# EAGLE board openx3 (EAGLE 9.5.2)
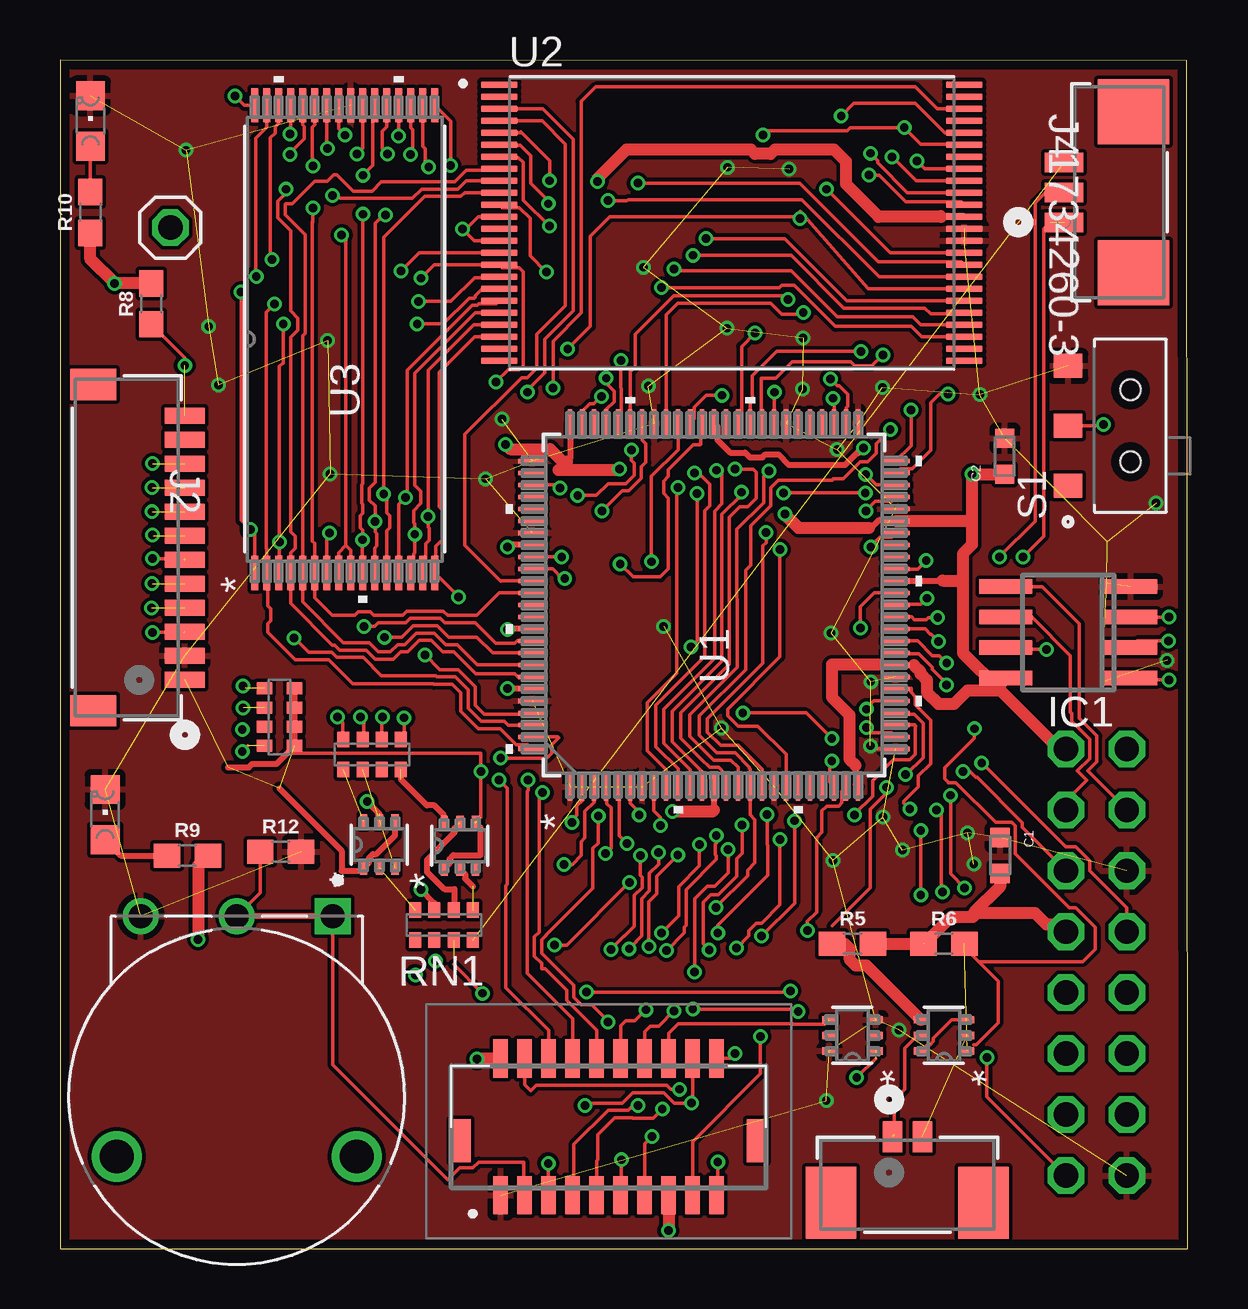
[diagram p2: board, top side]
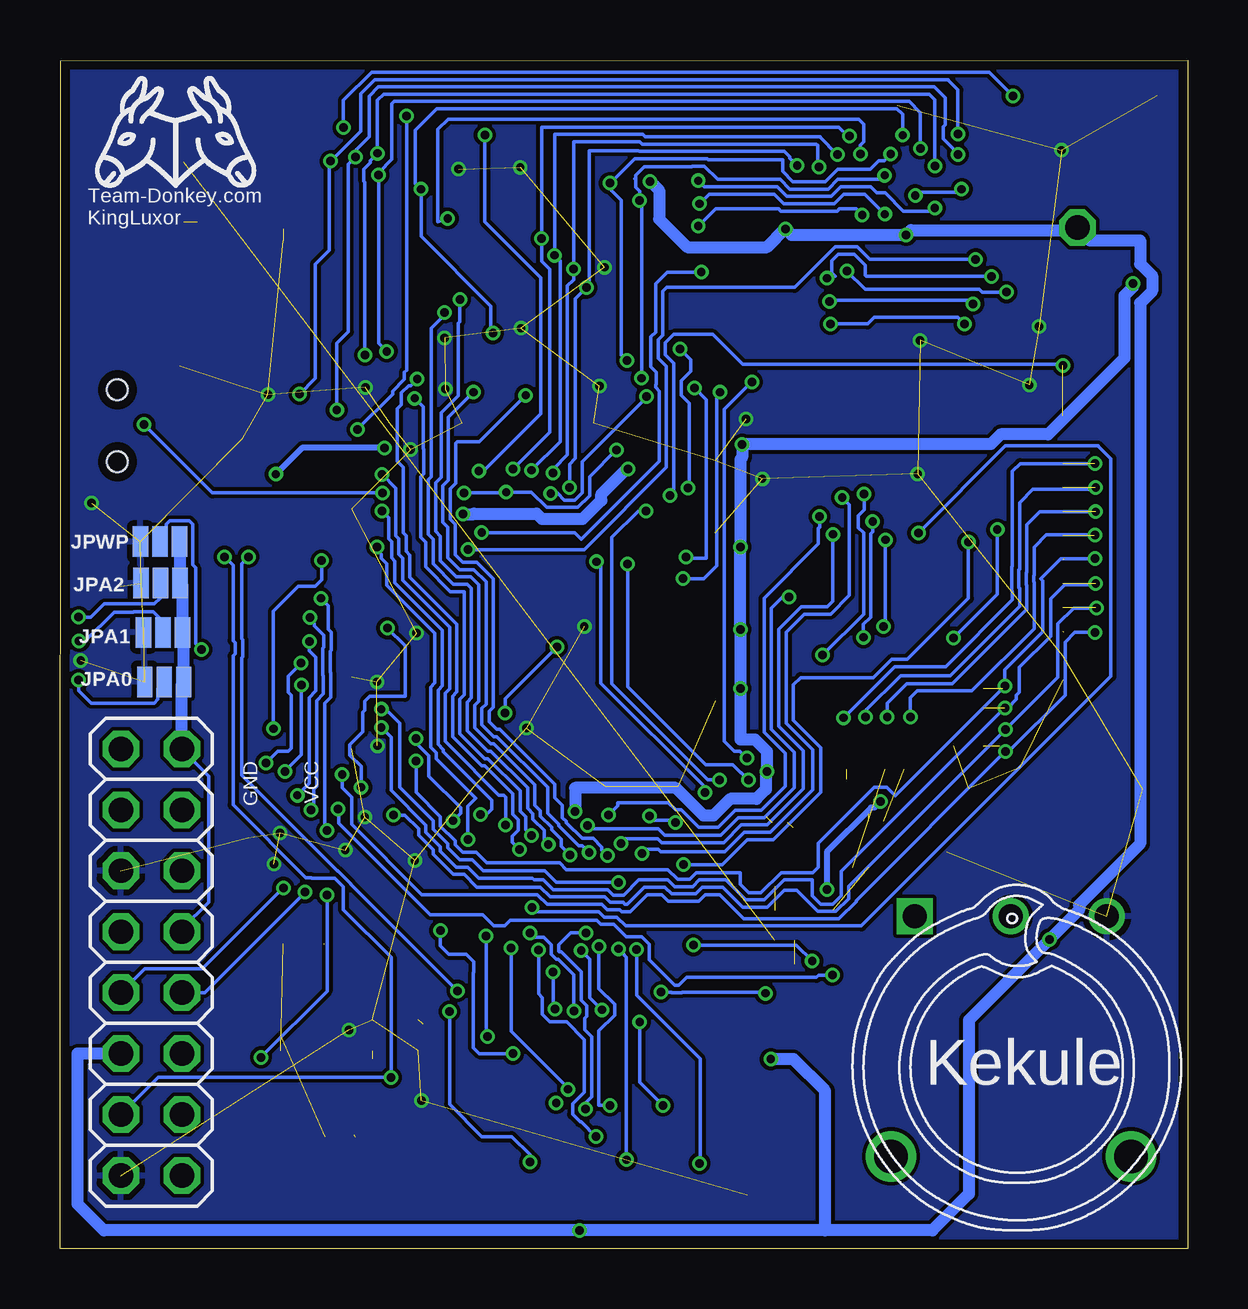
[diagram p3: board, bottom side, seen from below]

Size 46.99 x 49.53 mm. Coordinates in mm from the lower left corner, seen from the top.
Outline: 0,0 46.99,0 46.95,49.5 0,49.53 0,0
Copper layers (1*16): Top 0.035559375mm / dielectric 1.6mm / Bottom 0.035559375mm
Design rules "oshpark-2layer": minimum track width 6mil, minimum drill 10mil, track to track 6mil, track to pad 6mil, pad to pad 6mil, via to via 6mil, smd to smd 6mil, copper to edge 15mil, drill to drill 6mil, minimum pad ring 5mil, minimum via ring 5mil, stop-mask expansion 2.5mil, vias tented up to drill 0mil, thermal gap 10mil

## Footprints (pad centres in the part's own frame; a part is rotated, then mirrored left to right if it is on the bottom)
WCAP-CSGP_0603_REFLOW = smd 0.8 x 0.8: 1 -0.75,0; 2 0.75,0
SO-08 = smd 0.6 x 2.2: 1 -1.905,-2.6; 2 -0.635,-2.6; 3 0.635,-2.6; 4 1.905,-2.6; 5 1.905,2.6; 6 0.635,2.6; 7 -0.635,2.6; 8 -1.905,2.6
BM20BSRDSGTFLFSN = smd 0.6 x 1.6: 1 -4.5,-2.85; 2 -4.5,2.85; 3 -3.5,-2.85; 4 -3.5,2.85; 5 -2.5,-2.85; 6 -2.5,2.85; 7 -1.5,-2.85; 8 -1.5,2.85; 9 -0.5,-2.85; 10 -0.5,2.85; 11 0.5,-2.85; 12 0.5,2.85; 13 1.5,-2.85; 14 1.5,2.85; 15 2.5,-2.85; 16 2.5,2.85; 17 3.5,-2.85; 18 3.5,2.85; 19 4.5,-2.85; 20 4.5,2.85 | smd 0.85 x 1.8: 21 -6.175,-0.58; 22 6.175,-0.58
CONN_SM12B-SRSS-TB(LF)(SN) = smd 0.66 x 1.651: 1 5.5,-2.421; 2 4.5,-2.421; 3 3.5,-2.421; 4 2.5,-2.421; 5 1.5,-2.421; 6 0.5,-2.421; 7 -0.5,-2.421; 8 -1.5,-2.421; 9 -2.5,-2.421; 10 -3.5,-2.421; 11 -4.5,-2.421; 12 -5.5,-2.421 | smd 1.295 x 1.905: 13 -6.8,-6.236; 14 6.8,-6.236
CON00327_2 = smd 0.813 x 1.295: 1 -0.625,2.001; 2 0.625,2.001 | smd 2.108 x 2.997: 3 -3.175,-0.746; 4 3.175,-0.746
CON3_1X3_DRM125_HPI = smd 0.813 x 1.6: 1 1.25,0; 2 0,0; 3 -1.25,0 | smd 2.718 x 2.997: 4 -3.353,2.896; 5 3.353,2.896
2X08 = drill 1.016 octagon: 1 -8.89,-1.27; 2 -8.89,1.27; 3 -6.35,-1.27; 4 -6.35,1.27; 5 -3.81,-1.27; 6 -3.81,1.27; 7 -1.27,-1.27; 8 -1.27,1.27; 9 1.27,-1.27; 10 1.27,1.27; 11 3.81,-1.27; 12 3.81,1.27; 13 6.35,-1.27; 14 6.35,1.27; 15 8.89,-1.27; 16 8.89,1.27
1X01 = drill 1.016 octagon: 1 0,0
SMT-JUMPER_3_NO_NO-SILK = smd 0.635 x 1.27: 1 -0.813,0; 2 0,0; 3 0.813,0
CHIPLED_0805 = smd 1.2 x 1.2: A 0,-1.05; C 0,1.05
TRANS_UM6J1-L = smd 0.584 x 0.305: 1 -0.965,0.65; 2 -0.965,0; 3 -0.965,-0.65; 4 0.965,-0.65; 5 0.965,0; 6 0.965,0.65
0603 = smd 1.1 x 1: 1 -0.85,0; 2 0.85,0
TRIM_RV100F-30-4K1B-B10K-B301 = drill 1 square: 1 -4,-7.5 | drill 1: 2 0,-7.5; 3 4,-7.5 | drill 1.4: S1 -5,2.5; S2 5,2.5
0603-ARV = smd 0.5 x 0.65: 1 -1.2,-0.625; 2 -0.4,-0.625; 3 0.4,-0.625; 4 1.2,-0.625; 5 1.2,0.625; 6 0.4,0.625; 7 -0.4,0.625; 8 -1.2,0.625
SW_AYZ0102AGRLC = smd 1 x 1.2: 1 -2.5,2.45; 2 0,2.45; 3 2.5,2.45 | hole 0.85: -1.5,-0.15; 1.5,-0.15
TQFP100-L = smd 1.156 x 0.178: 1 -7.576,6; 2 -7.576,5.5; 3 -7.576,5; 4 -7.576,4.5; 5 -7.576,4; 6 -7.576,3.5; 7 -7.576,3; 8 -7.576,2.5; 9 -7.576,2; 10 -7.576,1.5; 11 -7.576,1; 12 -7.576,0.5; 13 -7.576,0; 14 -7.576,-0.5; 15 -7.576,-1; 16 -7.576,-1.5; 17 -7.576,-2; 18 -7.576,-2.5; 19 -7.576,-3; 20 -7.576,-3.5; 21 -7.576,-4; 22 -7.576,-4.5; 23 -7.576,-5; 24 -7.576,-5.5; 25 -7.576,-6; 51 7.576,-6; 52 7.576,-5.5; 53 7.576,-5; 54 7.576,-4.5; 55 7.576,-4; 56 7.576,-3.5; 57 7.576,-3; 58 7.576,-2.5; 59 7.576,-2; 60 7.576,-1.5; 61 7.576,-1; 62 7.576,-0.5; 63 7.576,0; 64 7.576,0.5; 65 7.576,1; 66 7.576,1.5; 67 7.576,2; 68 7.576,2.5; 69 7.576,3; 70 7.576,3.5; 71 7.576,4; 72 7.576,4.5; 73 7.576,5; 74 7.576,5.5; 75 7.576,6 | smd 0.178 x 1.156: 26 -6,-7.576; 27 -5.5,-7.576; 28 -5,-7.576; 29 -4.5,-7.576; 30 -4,-7.576; 31 -3.5,-7.576; 32 -3,-7.576; 33 -2.5,-7.576; 34 -2,-7.576; 35 -1.5,-7.576; 36 -1,-7.576; 37 -0.5,-7.576; 38 0,-7.576; 39 0.5,-7.576; 40 1,-7.576; 41 1.5,-7.576; 42 2,-7.576; 43 2.5,-7.576; 44 3,-7.576; 45 3.5,-7.576; 46 4,-7.576; 47 4.5,-7.576; 48 5,-7.576; 49 5.5,-7.576; 50 6,-7.576; 76 6,7.576; 77 5.5,7.576; 78 5,7.576; 79 4.5,7.576; 80 4,7.576; 81 3.5,7.576; 82 3,7.576; 83 2.5,7.576; 84 2,7.576; 85 1.5,7.576; 86 1,7.576; 87 0.5,7.576; 88 0,7.576; 89 -0.5,7.576; 90 -1,7.576; 91 -1.5,7.576; 92 -2,7.576; 93 -2.5,7.576; 94 -3,7.576; 95 -3.5,7.576; 96 -4,7.576; 97 -4.5,7.576; 98 -5,7.576; 99 -5.5,7.576; 100 -6,7.576
SOP50P2000X120-48N = smd 1.54 x 0.28: 1 -9.69,5.75; 2 -9.69,5.25; 3 -9.69,4.75; 4 -9.69,4.25; 5 -9.69,3.75; 6 -9.69,3.25; 7 -9.69,2.75; 8 -9.69,2.25; 9 -9.69,1.75; 10 -9.69,1.25; 11 -9.69,0.75; 12 -9.69,0.25; 13 -9.69,-0.25; 14 -9.69,-0.75; 15 -9.69,-1.25; 16 -9.69,-1.75; 17 -9.69,-2.25; 18 -9.69,-2.75; 19 -9.69,-3.25; 20 -9.69,-3.75; 21 -9.69,-4.25; 22 -9.69,-4.75; 23 -9.69,-5.25; 24 -9.69,-5.75; 25 9.69,-5.75; 26 9.69,-5.25; 27 9.69,-4.75; 28 9.69,-4.25; 29 9.69,-3.75; 30 9.69,-3.25; 31 9.69,-2.75; 32 9.69,-2.25; 33 9.69,-1.75; 34 9.69,-1.25; 35 9.69,-0.75; 36 9.69,-0.25; 37 9.69,0.25; 38 9.69,0.75; 39 9.69,1.25; 40 9.69,1.75; 41 9.69,2.25; 42 9.69,2.75; 43 9.69,3.25; 44 9.69,3.75; 45 9.69,4.25; 46 9.69,4.75; 47 9.69,5.25; 48 9.69,5.75
TS032 = smd 1.422 x 0.279: 1 -9.741,3.75; 2 -9.741,3.25; 3 -9.741,2.75; 4 -9.741,2.25; 5 -9.741,1.75; 6 -9.741,1.25; 7 -9.741,0.75; 8 -9.741,0.25; 9 -9.741,-0.25; 10 -9.741,-0.75; 11 -9.741,-1.25; 12 -9.741,-1.75; 13 -9.741,-2.25; 14 -9.741,-2.75; 15 -9.741,-3.25; 16 -9.741,-3.75; 17 9.741,-3.75; 18 9.741,-3.25; 19 9.741,-2.75; 20 9.741,-2.25; 21 9.741,-1.75; 22 9.741,-1.25; 23 9.741,-0.75; 24 9.741,-0.25; 25 9.741,0.25; 26 9.741,0.75; 27 9.741,1.25; 28 9.741,1.75; 29 9.741,2.25; 30 9.741,2.75; 31 9.741,3.25; 32 9.741,3.75

## Placement (x,y rotation side)
C1  [WCAP-CSGP_0603_REFLOW]  39.17,16.38 270 top
C2  [WCAP-CSGP_0603_REFLOW]  39.37,33.02 90 top
IC1  24AA256SN  [SO-08]  42.01,25.68 90 top
J1  BM20B-SRDS-G-TF(LF)(SN)  [BM20BSRDSGTFLFSN]  22.86,5.08 0 top
J2  SM12B-SRSS-TB(LF)(SN)  [CONN_SM12B-SRSS-TB(LF)(SN)]  7.62,29.21 270 top
J3  53398-0271  [CON00327_2]  35.31,2.67 0 top
J4  1734260-3  [CON3_1X3_DRM125_HPI]  41.83,44.02 270 top
JP1  [2X08]  43.18,11.94 90 bottom
JP2  [1X01]  4.6,42.55 0 top
JPA0  JUMPER-SMT_3_NO_NO-SILK  [SMT-JUMPER_3_NO_NO-SILK]  42.65,23.62 0 bottom
JPA1  JUMPER-SMT_3_NO_NO-SILK  [SMT-JUMPER_3_NO_NO-SILK]  42.7,25.68 0 bottom
JPA2  JUMPER-SMT_3_NO_NO-SILK  [SMT-JUMPER_3_NO_NO-SILK]  42.8,27.74 0 bottom
JPWP  JUMPER-SMT_3_NO_NO-SILK  [SMT-JUMPER_3_NO_NO-SILK]  42.82,29.46 0 bottom
LED1  [CHIPLED_0805]  1.27,46.99 0 top
LED2  [CHIPLED_0805]  1.88,18.08 0 top
R1  UM6K31NFHATCNTRANS_UM6J1-L  [TRANS_UM6J1-L]  36.83,8.89 180 top
R2  UM6K31NFHATCNTRANS_UM6J1-L  [TRANS_UM6J1-L]  33.02,8.89 180 top
R3  UM6K31NFHATCNTRANS_UM6J1-L  [TRANS_UM6J1-L]  16.66,16.79 90 top
R4  UM6K31NFHATCNTRANS_UM6J1-L  [TRANS_UM6J1-L]  13.31,16.84 90 top
R5  10k  [0603]  33.02,12.7 0 top
R6  10k  [0603]  36.83,12.7 0 top
R8  10k  [0603]  3.81,39.37 90 top
R9  200  [0603]  5.31,16.38 0 top
R10  200  [0603]  1.27,43.18 90 top
R11  RV100F-30-4K1B-B10K-B301  [TRIM_RV100F-30-4K1B-B10K-B301]  7.37,6.35 180 top
R12  4.7k  [0603]  9.19,16.54 0 top
RN1  10k  [0603-ARV]  16,13.49 0 top
RN2  10k  [0603-ARV]  9.14,22.15 90 top
RN3  100  [0603-ARV]  13,20.6 0 top
S1  AYZ0102AGRLC  [SW_AYZ0102AGRLC]  44.45,34.29 90 top
U1  LC4256V-75TN100CTQFP100-L  [TQFP100-L]  27.25,26.82 90 top
U2  AM29F016D-70EF  [SOP50P2000X120-48N]  27.99,42.75 0 top
U3  AM29F002BB90EI  [TS032]  11.86,37.9 90 top
U$1  [KEKULE-0002]  13.97,0.76 0 bottom

## Tracks (layer width: path | path; a pad name or v marks a point on that pad's centre or on a via)
+3V3  (via drill 0.35)  (5 unrouted)
  Top 0.152: 9.49,20.67 9.53,20.64 17.54,20.64 v17.54,19.88 17.54,17.98
  Top 0.254: U1.45 34.78,30.37 34.14,30.37 33.8,30.03 33.71,30.03 | U1.13 27.25,18.71 27.25,18.28 | U1.83 18.73,29.32 v18.64,29.23 | U1.90 18.66,25.82 v18.64,25.81 | U1.95 18.66,23.32 v18.64,23.34 | U1.75 21.25,32.92 21.13,32.8 20.78,32.44 | U1.63 27.39,34.27 27.39,33.7 27.92,33.17 28.54,33.17 28.74,32.97 29.27,32.97 29.39,33.09 29.94,33.09 30.37,32.66 32.72,32.66 33.2,33.15 33.26,33.15 v33.48,33.37 | 36.78,27.84 34.85,27.84 U1.40 | 34.09,24.33 34.1,24.32 U1.33 35.58,24.32 | 33.15,20.14 33.15,19.35 U1.25 | 38.08,13.99 38.2,13.99 | 9.49,20.67 9.01,20.19 8,20.19 7.87,20.06 6.99,20.06 | RN2.4 RN2.3 RN2.2 RN2.1 | 9.14,19.18 11.73,16.59 11.73,15.75 12.53,15.75 R4.1 12.88,16.09 12.88,16.28 13.04,16.45 13.17,16.45 13.96,17.24 R4.4 | R3.1 16.23,16.04 16.23,16.23 16.39,16.4 17.53,16.4 17.53,17.54 R3.4
  Top 0.508: C1.2 39.17,15.09 38.08,13.99 | C2.1 v38,32.27 38,30.35 | R8.2 v2.27,40.22 1.27,41.22 R10.1 | v18.57,33.5 18.75,33.32 20.43,33.32 20.94,32.8 21.13,32.8 | 27.25,18.28 27.18,18.21 v25.53,18.21 | v23.32,32.49 23.27,32.44 20.78,32.44 | JP1.9 41.6,13.52 41.1,13.52 40.62,13.99 38.2,13.99 38.02,13.82 37.12,13.82 36.01,12.7 | 37.62,27.84 37.62,28.96 38,29.34 38,30.35 | 37.62,27.84 37.62,24.82 39.17,23.27 | JP1.15 41.61,20.83 39.17,23.27 | 35.58,24.32 35.86,24.04 35.86,23.95 36.12,23.69 36.12,23.2 36.61,22.71 37.26,22.71 37.82,23.27 39.17,23.27 | 34.09,24.33 32.16,24.33 32.16,22.99 32.9,22.25 32.9,20.4 33.15,20.14 | 33.71,30.03 30.78,30.03 v30.2,30.61 | 39.17,23.27 39.17,23.53 IC1.8 | 38,30.35 37.97,30.32 U1.45 | 36.78,27.84 37.62,27.84 | R5.2 R6.1
  Bottom 0.152: JP1.9 41.91,13.33 40.8,14.45 40.8,19.68 41.75,20.64 JP1.15
  Bottom 0.254: v33.48,33.37 36.9,33.37 v38,32.27
  Bottom 0.508: v30.2,30.61 29.76,30.61 29.74,30.62 27.13,30.62 26.91,30.41 25.21,30.41 24.44,31.18 24.44,31.44 23.36,32.52 v23.32,32.49 | v25.53,18.21 25.53,19.2 21.34,19.2 20.18,18.04 19.76,18.04 19.05,18.75 17.97,18.75 17.58,19.14 17.58,19.84 v17.54,19.88 17.54,20.72 18.04,21.23 18.64,21.23 v18.64,23.34 v18.64,25.81 18.67,25.83 18.67,29.21 v18.64,29.23 18.64,32.89 18.57,32.97 v18.57,33.5 18.54,33.53 8.2,33.53 7.79,33.93 5.82,33.93 2.64,37.11 2.64,39.71 2.27,40.08 v2.27,40.22 | JPWP.3 41.99,29.44 JPA2.3 41.89,27.63 JPA1.3 41.83,25.63 JPA0.3 41.91,23.55 JP1.15
+5V  (via drill 0.35)
  Top 0.152: U2.12 17.44,43 16.93,42.49 v16.76,42.49 17.26,42 U2.14 | v11.73,42.24 11.91,42.06 11.91,29.31 | U3.9 12.11,29.11 11.91,29.31 | U3.8 11.61,28.88 11.61,29.01 11.91,29.31
  Top 0.254: U2.37 37.66,43.02 36.69,43.02
  Top 0.508: 36.69,43.02 36.72,43 34.11,43 32.75,44.36 32.75,45.3 32.26,45.8 29.79,45.8 29.61,45.62 28.96,45.62 28.79,45.8 23.6,45.8 22.4,44.6 v22.4,44.48 | J1.15 25.36,0.77 v25.35,0.76 | v17.37,7.9 17.4,7.93 J1.2 | R9.2 5.75,15.98 v5.75,12.89
  Bottom 0.508: v22.4,44.48 22.02,44.09 22.02,42.9 20.85,41.73 17.53,41.73 v16.76,42.49 16.51,42.24 v11.73,42.24 11.53,42.44 4.7,42.44 JP2.1 4.06,42.01 1.98,42.01 1.98,41.04 1.49,40.55 1.49,39.9 1.98,39.4 1.98,16.88 4.53,14.33 4.53,14.12 v5.75,12.89 9.12,9.53 9.12,2.29 10.64,0.76 15.11,0.76 | 15.11,0.76 v25.35,0.76 45.16,0.76 46.25,1.85 46.25,8.13 JP1.6 | 15.11,0.76 15.11,6.58 16.43,7.9 v17.37,7.9
A0  (via drill 0.35)
  Top 0.152: U3.20 14.11,46.38 v14.1,46.37 | U2.30 32.79,39.5 30.2,42.09 v26.92,42.09 | v28.12,32.49 28.88,32.49 29,32.36 29,31.27 28.65,30.91 28.32,30.91 27.89,30.48 27.89,24.34 25.88,22.33 25.88,21.26 26.72,20.4 27.06,20.05 27.44,20.05 27.7,19.79 27.7,19.3 U1.14
  Bottom 0.152: v14.1,46.37 14.18,46.37 14.54,46.73 26.92,46.73 v26.92,42.09 26.92,41.15 26.59,40.82 26.59,34.01 v28.12,32.49
A1  (via drill 0.35)
  Top 0.152: U3.19 14.61,46.72 14.71,46.62 14.71,45.69 v14.6,45.59 | v26.38,41.39 30.46,41.39 32.66,39.19 36.04,39.19 36.27,38.96 37.65,38.96 U2.29 | v27.35,32.44 27.52,32.6 27.58,32.54 27.58,31.03 27.28,30.73 27.28,24.61 25.15,22.48 25.15,21.06 26.25,19.95 U1.11
  Bottom 0.152: v14.6,45.59 15.32,46.3 15.32,46.33 22.61,46.33 22.71,46.43 26.38,46.43 v26.38,41.39 26.15,41.17 26.15,33.63 v27.35,32.44
A2  (via drill 0.35)
  Top 0.152: U3.18 15.11,45.94 15.21,45.84 15.21,45.22 v15.36,45.06 | v25.59,40.83 25.59,40.78 25.61,40.75 30.47,40.75 32.38,38.84 35.54,38.84 35.87,38.5 U2.28 | v26.44,32.33 26.59,32.33 27.07,31.85 27.07,30.96 26.87,30.75 26.87,24.69 24.82,22.64 24.82,20.92 25.75,19.99 U1.10
  Bottom 0.152: v15.36,45.06 15.42,45.12 15.42,45.97 15.47,46.03 22.74,46.03 22.84,46.12 25.59,46.12 v25.59,40.83 25.59,40.38 25.84,40.12 25.84,33.08 26.44,32.48 v26.44,32.33
A3  (via drill 0.35)
  Top 0.152: U3.17 16.27,46.98 v16.27,45.14 | U2.27 35.9,38 35.47,38.43 32.31,38.43 30.58,40.16 30.08,40.16 29.97,40.05 v25.06,40.05 | U1.9 25.25,19.96 24.47,20.75 24.47,22.74 25.7,23.98 25.7,31.67 v25.76,31.72
  Bottom 0.152: v16.27,45.14 16.57,45.44 16.57,45.49 16.8,45.72 22.86,45.72 22.89,45.75 24.94,45.75 24.94,40.16 v25.06,40.05 25.52,39.59 25.52,32.93 25.76,32.69 v25.76,31.72
A4  (via drill 0.35)
  Top 0.152: U2.22 17.27,38 15.8,36.53 15.8,30.91 15.95,30.76 15.95,29.56 15.65,29.26 15.65,28.19 U3.16 v16.61,27.16 v16.61,27.15 | U1.8 24.74,19.23 24.74,18.25 25.02,17.97 v25.02,17.63
  Bottom 0.152: v16.61,27.15 16.89,27.15 17.35,26.7 17.35,21.65 16.39,20.69 16.39,19.22 17.65,17.96 18.73,17.96 19.47,17.22 21.78,17.22 22.06,17.5 24.89,17.5 v25.02,17.63
A5  (via drill 0.35)
  Top 0.152: U3.15 15.24,28.29 15.24,29.37 15.39,29.52 15.39,30.02 15.34,30.07 v15.34,30.5 15.34,36.6 17.24,38.5 U2.21 | U1.6 23.75,18.56 24.13,18.18 v24.13,18.08
  Bottom 0.152: v15.34,30.5 15.34,30.07 15.39,30.02 15.39,29.36 17.65,27.1 17.65,21.52 16.78,20.65 16.78,19.26 17.77,18.27 18.86,18.27 19.56,17.56 20.38,17.56 21.11,18.29 21.34,18.29 21.64,18.59 23.75,18.59 23.75,18.46 v24.13,18.08
A6  (via drill 0.35)
  Top 0.152: U3.14 14.74,28.29 14.74,28.96 14.78,29 v14.78,29.77 14.78,30.21 14.73,30.25 14.73,30.76 15.04,31.06 15.04,31.57 14.78,31.82 14.78,36.47 17.31,39 U2.20 | U1.5 23.3,19.2 23.3,17.2 v23.62,16.89
  Bottom 0.152: v14.78,29.77 14.78,26.97 15.01,26.75 16.1,26.75 17.04,25.81 17.04,21.77 16.01,20.74 16.01,19.16 17.52,17.66 18.6,17.66 19.34,16.92 21.91,16.92 22.08,17.09 23.41,17.09 v23.62,16.89
A7  (via drill 0.35)
  Top 0.152: U2.19 18.17,39.37 17.46,39.37 17.39,39.3 17.18,39.3 14.48,36.6 14.48,31.38 v14.4,31.3 14.11,31.01 U3.13 | v22.73,16.46 22.96,16.69 22.96,18.36 22.78,18.54 22.78,19.22 U1.4
  Bottom 0.152: v22.73,16.46 22.55,16.64 22.07,16.64 21.96,16.54 19.29,16.54 18.48,17.35 17.39,17.35 15.62,19.13 15.62,20.78 16.74,21.9 16.74,25.68 15.98,26.44 14.88,26.44 14.1,27.23 14.1,31 v14.4,31.3
A8  (via drill 0.35)
  Top 0.152: U3.3 9.14,28.19 v9.14,29.44 9.14,36.76 9.28,36.9 9.3,36.9 v9.3,38.52 | U2.18 17.59,40 17.3,39.71 17.3,39.64 17.27,39.61 17.05,39.61 15.98,38.53 v14.88,38.53 | U1.3 22.25,18.61 21.87,18.23 21.87,17.12 21.72,16.96 21.72,16.39 21.34,16 v21.01,16
  Bottom 0.152: v9.3,38.52 9.58,38.8 13.06,38.8 13.33,38.53 v14.88,38.53 | v9.14,29.44 9.14,27.1 11.68,24.56 12.33,24.56 13.09,23.8 16.13,23.8 16.43,23.5 16.43,22.03 15.29,20.88 15.29,19.03 17.27,17.05 18.35,17.05 19.39,16 v21.01,16
A9  (via drill 0.35)
  Top 0.152: U1.100 19.5,21 19.01,21 18.34,21.67 17.43,21.67 16.7,22.39 16.7,23.16 16.34,23.52 15.57,23.52 15.55,23.55 12.2,23.55 11.21,24.54 9.81,24.54 8.66,25.68 8.66,26.04 8.79,26.16 8.79,26.67 8.66,26.79 8.66,28.11 U3.2 8.61,29.16 8.59,29.19 8.59,39.02 v8.94,39.37 | U2.17 18.27,40.46 17.27,40.46 16.28,39.47 v14.93,39.47
  Bottom 0.152: v8.94,39.37 9.09,39.52 14.88,39.52 v14.93,39.47
A10  (via drill 0.35)
  Top 0.152: U3.31 8.61,46.74 8.15,46.28 8.15,40.54 v8.18,40.51 | v8.18,40.51 8.2,40.49 v8.18,40.51 | v15.04,40.44 15.6,41 U2.16 18.43,40.87 19.14,40.87 19.3,40.71 19.3,36.78 19.14,36.63 18.67,36.63 v18.16,36.12 | v18.36,20.44 20.29,20.44 20.48,20.64 20.48,20.99 20.78,21.29 20.74,21.32 U1.99
  Bottom 0.152: v15.04,40.44 14.96,40.51 14.69,40.51 14.84,40.66 14.84,41.17 14.56,41.45 13.9,41.45 13.44,40.99 13.44,40.56 13.4,40.51 v8.18,40.51 | v18.16,36.12 19.3,34.98 19.3,21.15 18.89,20.74 18.66,20.74 v18.36,20.44
A11  (via drill 0.35)
  Top 0.152: U2.15 14.96,41.5 v14.2,40.74 | v7.55,39.86 7.55,30.35 v7.94,29.96 8.11,29.79 U3.1 | v9.75,25.45 10.36,24.84 11.33,24.84 11.53,24.64 12.63,24.64 13.4,23.87 15.65,23.87 15.7,23.82 16.47,23.82 17,23.29 17,22.52 17.55,21.97 18.52,21.97 18.67,21.82 U1.98
  Bottom 0.152: v7.55,39.86 8.57,39.86 8.69,39.98 13.44,39.98 v14.2,40.74 | v7.94,29.96 7.94,27.27 v9.75,25.45
A12  (via drill 0.35)
  Top 0.152: U2.10 16.85,44 16.7,43.85 15.2,43.85 13.49,42.15 v13.49,31.45 | U3.12 13.61,29.92 13.73,30.05 13.73,30.55 13.62,30.66 13.62,31.45 v13.49,31.45 | v13.49,31.45 | v15.21,24.74 15.83,24.13 16.6,24.13 17.31,23.41 17.31,22.64 17.68,22.28 19.63,22.28 U1.97
  Bottom 0.152: v13.49,31.45 13.49,30.79 13.73,30.55 13.73,30.05 13.51,29.82 13.51,26.44 v15.21,24.74
A13  (via drill 0.35)
  Top 0.152: U1.94 19.1,23.82 19.09,23.81 18.95,23.95 17.33,23.95 16.42,24.87 15.95,24.87 15.47,25.35 14.96,25.35 14.48,24.87 14.19,24.87 13.89,24.57 13.13,24.57 12.75,24.95 11.66,24.95 11.46,25.15 11.35,25.15 9.61,26.89 U3.4 9.61,29 9.8,29.19 9.8,29.69 9.61,29.88 9.61,37.97 9.91,38.27 9.91,38.78 9.61,39.08 9.61,42.41 9.07,42.96 9.07,43.64 9.42,43.99 v9.42,44.15 | v11.35,43.89 11.56,43.89 11.68,43.77 14.68,43.77 15.07,44.15 16.58,44.15 16.92,44.5 U2.9
  Bottom 0.152: v11.35,43.89 11.23,44.02 9.55,44.02 v9.42,44.15
A14
  Top 0.152: U2.8 18.23,44.93 16.93,44.93 16.45,44.46 13.39,44.46 13,44.07 12.22,44.07 11.54,44.75 11.41,44.75 11.13,44.48 10.61,44.48 9.67,43.54 9.4,43.54 9.38,43.51 9.38,43.08 10.22,42.24 10.22,38.15 10.11,38.04 U3.5 10.11,26.95 11.81,25.25 12.88,25.25 13.26,24.87 13.76,24.87 14.07,25.17 14.36,25.17 14.84,25.65 15.59,25.65 16.07,25.17 16.54,25.17 17.39,24.32 U1.93
A15  (via drill 0.35)
  Top 0.152: U1.92 18.03,24.82 17.37,25.48 16.2,25.48 15.72,25.96 14.71,25.96 14.23,25.48 v13.51,25.48 | U3.11 13.11,29.2 13.21,29.29 13.21,29.79 13.13,29.87 v13.13,30.3 13.13,30.95 12.88,31.19 12.88,31.7 13.13,31.94 13.13,42.72 13.49,43.08 v13.56,43.08 | v20.4,42.61 19.31,43.7 19.31,45.26 19.1,45.47 18.33,45.47 U2.7
  Bottom 0.152: v13.13,30.3 13.13,29.87 13.21,29.79 13.21,26.32 13.51,26.01 v13.51,25.48 | v13.56,43.08 13.82,43.33 14.51,43.33 14.61,43.24 16.96,43.24 17.05,43.33 19.67,43.33 v20.4,42.61
A16  (via drill 0.35)
  Top 0.152: U2.6 18.32,45.97 19.18,45.97 19.61,45.54 19.61,44.4 20.34,43.67 v20.34,43.54 | U1.91 19.04,25.32 18.95,25.22 18.16,25.22 17.3,26.08 16.02,26.08 15.84,26.26 14.58,26.26 14.41,26.08 13.26,26.08 13.11,25.93 v12.67,25.93 | v12.62,43.1 12.62,31.87 12.58,31.82 12.58,31.07 12.62,31.02 12.62,30.65 12.52,30.55 12.52,30.05 12.62,29.94 12.62,29.57 v12.6,29.54 12.6,28.17 U3.10
  Bottom 0.152: v12.6,29.54 12.6,26.01 v12.67,25.93 | v12.62,43.1 13.46,43.94 14.33,43.94 14.73,43.54 16.83,43.54 17.23,43.94 19.95,43.94 v20.34,43.54
A17  (via drill 0.35)
  Top 0.152: U2.5 19.17,46.5 19.2,46.53 20.4,45.34 v20.4,44.5 | U1.87 18.3,27.32 17.37,26.39 16.15,26.39 15.97,26.57 14.46,26.57 14.28,26.39 13.08,26.39 12.93,26.54 12.42,26.54 12.27,26.39 11.35,26.39 10.61,27.13 U3.6 10.62,29.39 10.52,29.48 10.52,42.8 10.54,42.78 v10.54,43.36
  Bottom 0.152: v10.54,43.36 10.66,43.23 11.84,43.23 12.6,43.99 12.95,43.99 13.21,44.25 14.46,44.25 14.86,43.85 16.7,43.85 17.1,44.25 20.14,44.25 v20.4,44.5
A18
  Top 0.152: U2.4 20.09,46.99 21.06,46.03 21.06,39.29 19.86,38.1 19.86,36.68 19.48,36.29 19.23,36.29 16.87,33.93 16.87,29.31 18.36,27.81 18.37,27.82 U1.86
A19  (via drill 0.35)
  Top 0.152: U2.3 | U2.3 20.12,47.5 21.39,46.23 21.39,39.09 20.19,37.9 20.19,36.5 19.48,35.79 v19.48,35.69 | v21.03,27.92 20.92,27.92 20.52,28.32 U1.85
  Bottom 0.152: v19.48,35.69 19.63,35.54 19.63,28.45 20.16,27.92 v21.03,27.92
A20  (via drill 0.35)
  Top 0.152: U2.46 36.55,47.5 35.64,48.41 22.33,48.41 21.72,47.8 21.72,38.99 20.55,37.82 v20.55,35.87 | v20.9,28.83 U1.84
  Bottom 0.152: v20.55,35.87 20.07,35.38 20.07,28.78 20.85,28.78 v20.9,28.83
BLUELED  (via drill 0.35)  (1 unrouted)
  Top 0.152: v3.84,30.71 v3.83,30.71 | RN3.7 12.63,21.25 12.65,21.23 12.65,22.15 v12.52,22.15
  Bottom 0.152: v12.52,22.15 12.52,22.73 11.71,23.55 9.8,23.55 6.73,26.62 6.71,26.62 6.71,27.64 6.73,27.66 6.73,28.17 6.71,28.19 6.71,30.18 6.17,30.71 v3.83,30.71
BLUELED_O  (1 unrouted)
BLUELEDACT  (via drill 0.35)  (1 unrouted)
  Top 0.254: 13.31,18.12 v12.8,18.63 | v15.04,14.97 15.6,14.4 RN1.7
  Bottom 0.254: v12.8,18.63 13.05,18.38 13.19,18.38 15.04,16.53 v15.04,14.97
BUFLCE#  (via drill 0.35)
  Top 0.152: U3.30 9.11,46.9 8.97,46.76 8.97,46.49 8.77,46.28 8.77,41.3 v8.84,41.22 | U1.19 30.25,20.6 29.08,21.77 28.26,21.77 27.82,22.21 27.82,22.48 30,24.66 v30,29.13
  Bottom 0.152: v30,29.13 25.15,29.13 21.72,32.56 21.72,36.77 22.07,37.11 22.07,37.87 21.87,38.07 21.87,39.9 21.72,40.06 16.38,40.06 14.68,41.75 13.78,41.75 13.25,41.22 v8.84,41.22
D0_O  (via drill 0.35)  (2 unrouted)
  Top 0.152: 41.27,42.77 41,42.49 41,29.69 v40.13,28.83 | 33.99,7.93 v33.2,7.14
  Bottom 0.152: v40.13,28.83 39.78,28.47 39.78,25.34 39.68,25.24 39.68,24.8 39.78,24.7 39.78,18.49 36.75,15.47 36.52,15.47 36.5,15.44 35.54,15.44 35.18,15.08 35.18,14.12 33.2,12.14 v33.2,7.14 42.9,7.14 JP1.4
DB0  (via drill 0.35)
  Top 0.152: U1.70 23.75,36.54 23.97,36.76 23.97,38.1 25.57,39.7 30.18,39.7 v30.33,39.55 | J1.7 21.41,2.28 21.41,4.34 22.84,5.77 23.68,5.77 23.88,5.97 v24.08,5.97 | v25.74,16.4 24.86,15.52 24.86,14.79 24.54,14.47 v24.54,12.6
  Bottom 0.152: v30.33,39.55 30.33,38.63 30.4,38.56 30.4,35.54 31.11,34.82 31.11,32.14 31.34,31.91 31.34,29.89 31.14,29.68 31.14,28.66 30.47,27.99 29.88,27.99 29.54,27.66 29.54,22.82 29.71,22.65 29.71,21.7 29.05,21.03 28.91,21.03 27.2,19.33 27.2,18.48 26.98,18.25 26.98,18.02 26.51,17.56 26.51,17.45 26.11,17.06 26.11,16.77 v25.74,16.4 | v24.08,5.97 24.54,5.97 24.54,9.08 23.88,9.74 23.88,10.18 24.54,10.83 v24.54,12.6
DB1  (via drill 0.35)
  Top 0.152: J1.8 21.36,9.58 19.46,11.48 19.46,19.06 19.51,19.11 v19.51,19.53 | U1.69 24.25,33.69 24.41,33.53 24.41,32.77 24.23,32.58 24.23,32.11 23.7,31.57 23.42,31.57 v22.58,30.73
  Bottom 0.152: v22.58,30.73 22.91,30.73 24,29.64 24,23.54 19.99,19.53 v19.51,19.53
DB2  (via drill 0.35)
  Top 0.152: U1.67 25.25,38.92 25.73,39.4 29.62,39.4 30.08,38.94 30.9,38.94 v30.97,39.01 | J1.9 22.36,3.67 22.4,3.71 22.4,4.75 23.11,5.46 23.84,5.46 23.86,5.44 24.72,5.44 v25.09,5.82 | v26.64,16.84 26.64,15.95 25.78,15.09 25.78,13.87 v25.07,13.16
  Bottom 0.152: v30.97,39.01 30.97,38.9 31.52,38.35 31.52,32.16 31.65,32.04 31.65,29.76 31.44,29.56 31.44,28.54 30.6,27.69 30.02,27.69 29.84,27.51 29.84,22.95 30.02,22.77 30.02,21.58 29.17,20.73 29.04,20.73 27.51,19.2 27.51,18.35 27.28,18.12 27.28,17.9 26.81,17.43 26.81,17.01 v26.64,16.84 | v25.09,5.82 25.12,5.84 25.12,6.04 24.84,6.32 24.84,8.84 25.12,9.12 25.12,9.61 25.05,9.69 25.05,10.13 25.27,10.35 25.27,11.54 26.09,12.37 26.18,12.37 26.21,12.39 26.21,12.65 25.71,13.16 v25.07,13.16
DB3  (via drill 0.35)
  Top 0.152: v24.64,28.63 24.64,32.18 25.75,33.3 U1.66 | v20.11,19 19.96,18.86 19.96,13.2 19.76,12.99 19.76,12.19 20.07,11.89 20.07,11.66 20.22,11.66 21.11,10.77 21.11,10.35 22.36,9.1 J1.10
  Bottom 0.152: v20.11,19 20.11,19.22 24.46,23.57 24.46,28.45 v24.64,28.63
DB4  (via drill 0.35)
  Top 0.152: U1.58 29.75,35.29 29.77,35.31 v29.77,35.69 | v24.94,16.51 24.94,16.03 24.56,15.65 24.56,14.92 24.23,14.59 24.23,13.04 24.01,12.82 24.01,12.79 v23.72,12.5 | v23.39,3.71 23.39,2.26 J1.11
  Bottom 0.152: v29.77,35.69 30.81,34.65 30.81,32.01 31.04,31.79 31.04,30.26 30.83,30.06 30.83,28.79 30.34,28.3 29.75,28.3 29.23,27.78 29.23,22.7 29.41,22.52 29.41,21.83 28.92,21.34 28.79,21.34 26.67,19.23 26.67,18.15 26.2,17.68 26.2,17.63 25.36,16.79 25.22,16.79 v24.94,16.51 | v23.72,12.5 23.49,12.27 23.49,12.25 23.39,12.15 v23.39,3.71
DB5  (via drill 0.35)
  Top 0.152: U1.53 32.25,35.39 v32.21,35.44 | v24.41,9.96 23.95,9.5 23.57,9.5 23.36,9.29 J1.12 | v27.34,17.21 27.34,16.89 27.31,16.86 27.31,16.42 27.34,16.38 27.34,16.22 26.09,14.96 26.09,13.48 26.01,13.4 26.01,13.16 v25.27,12.42
  Bottom 0.152: v32.21,35.44 31.85,35.08 31.85,33.34 31.83,33.31 31.83,32.29 31.95,32.16 31.95,29.63 31.75,29.43 31.75,28.41 30.72,27.38 30.15,27.38 30.15,23.07 30.32,22.9 30.32,21.45 29.3,20.42 29.16,20.42 27.81,19.07 27.81,18.22 27.59,18 27.59,17.45 v27.34,17.21 | v25.27,12.42 24.92,12.06 24.92,10.46 v24.41,9.96
DB6  (via drill 0.35)
  Top 0.152: U1.48 34.01,31.82 v33.57,32.26 v33.57,32.27 | v28.42,17.65 28.42,16.47 28.2,16.24 28.2,15.52 27.43,14.75 27.11,14.75 26.8,14.44 26.8,12.91 26.8,12.7 v27.05,12.45 | v24.66,4.67 24.36,4.37 J1.13
  Bottom 0.152: v33.57,32.27 33,31.69 33,29.71 32.87,29.58 32.87,28.93 32.71,28.78 32.71,27.85 30.76,25.9 30.76,23.33 30.93,23.15 30.93,21.14 30.71,20.92 30.71,20.91 28.7,18.9 28.5,18.9 28.42,18.82 v28.42,17.65 | v24.66,4.67 25.28,5.29 25.32,5.29 25.63,5.6 25.63,6.04 25.15,6.52 25.15,8.71 25.88,9.45 26.59,9.45 26.9,9.76 26.9,10.46 27.05,10.62 v27.05,12.45
DB7  (via drill 0.35)
  Top 0.152: U1.47 34.65,31.14 33.97,31.14 33.62,30.79 v33.58,30.75 v33.58,30.74 | v27.41,13.16 v27.4,13.16 27.4,13.48 29.49,15.57 29.49,16.8 29.47,16.82 29.47,17.98 29.46,17.98 v29.46,18.09 | v25.58,9.91 24.94,9.27 24.59,9.27 24.36,9.04 J1.14
  Bottom 0.152: v29.46,18.09 29.23,18.09 29.01,18.31 29.01,18.69 31.02,20.7 31.02,20.79 31.24,21.02 31.24,23.28 31.06,23.45 31.06,25.77 33.04,27.75 33.04,28.65 33.18,28.78 33.18,29.45 33.3,29.58 33.3,30.46 v33.58,30.74 | v27.41,13.16 27.23,12.98 26.83,12.98 26.52,12.67 26.52,12.27 26.31,12.06 26.22,12.06 25.58,11.42 v25.58,9.91
DQ0  (via drill 0.35)
  Top 0.152: U3.21 13.61,46.75 13.43,46.57 13.43,45.83 v13.64,45.62 | U2.31 34.04,40 34.04,40.01 33.68,40.01 30.84,43.23 v30.84,42.93 30.76,43 22.91,43 22.1,42.19 22.1,38.43 v21.16,37.49 | v20.83,31.7 20.7,31.83 19.8,31.83 19.8,31.82 U1.78
  Bottom 0.152: v13.64,45.62 13.64,45.97 13.49,46.12 13.49,46.84 13.72,47.07 30.81,47.07 31.24,46.63 31.24,42.8 v30.84,42.93 | v21.16,37.49 20.7,37.04 20.7,36.57 21.11,36.16 21.11,35.57 20.78,35.24 20.78,31.75 v20.83,31.7
DQ1  (via drill 0.35)
  Top 0.152: U3.22 13.04,47.56 13.04,45.14 v12.63,44.73 | U2.32 34.13,40.5 30.91,43.71 23.67,43.71 23.62,43.67 v22.84,43.67 | U1.72 22.76,34.97 23.09,35.3 23.09,35.74 22.76,36.06 v22.76,36.27
  Bottom 0.152: v22.76,36.27 22.76,43.59 v22.84,43.67 22.84,44.05 23.01,44.22 23.01,44.55 23.04,44.58 23.01,44.61 23.01,44.73 22.65,45.09 20.67,45.09 20.65,45.11 20.14,45.11 19.59,44.55 16.98,44.55 16.58,44.15 14.98,44.15 14.59,44.55 12.8,44.55 v12.63,44.73
DQ2  (via drill 0.35)
  Top 0.152: U3.23 12.61,45.85 v12.38,45.61 | U2.33 37.55,41.13 34.1,41.13 30.83,44.4 v24.08,44.4 | v23.37,37.01 23.37,35.88 23.39,35.86 23.39,34.53 U1.71
  Bottom 0.152: v23.37,37.01 23.6,37.24 23.6,43.69 24.08,44.17 v24.08,44.4 24.05,44.4 23.04,45.41 20.02,45.41 19.97,45.36 16.88,45.36 16.88,44.88 16.45,44.46 15.11,44.46 14.59,44.98 14.37,44.98 13.23,44.98 12.88,45.33 12.65,45.33 v12.38,45.61
DQ3  (via drill 0.35)
  Top 0.152: U3.25 11.61,46.66 v11.88,46.4 | v31.95,44.15 34.59,41.5 U2.34 | v28.96,38.15 28.4,37.59 28.4,34.54 U1.61
  Bottom 0.152: v11.88,46.4 11.88,47.26 12.12,47.5 31.29,47.5 32.18,46.61 32.18,44.38 v31.95,44.15 31.95,42.18 29.03,39.27 29.03,38.23 v28.96,38.15
DQ4  (via drill 0.35)
  Top 0.152: U2.38 37.55,43.63 35.25,43.63 34.14,44.74 v33.72,44.74 | v11.14,45.85 11.11,45.88 U3.26 | U1.60 28.75,35.29 28.85,35.39 28.85,36.37 29.87,37.39 v33.38,37.39
  Bottom 0.152: v11.14,45.85 11.14,47.34 11.61,47.8 33.07,47.8 33.16,47.72 33.16,45.39 33.72,44.83 v33.72,44.74 33.72,37.73 v33.38,37.39
DQ5  (via drill 0.35)
  Top 0.152: U3.27 10.61,46.83 10.51,46.72 10.51,45.13 v10.54,45.11 | v33.77,45.64 34.07,45.34 34.07,45.24 35.31,44 U2.39 | v34.28,37.24 33.83,36.78 33.12,36.78 32.95,36.96 30.5,36.96 29.82,36.27 29.21,36.27 29.21,34.44 U1.59
  Bottom 0.152: v10.54,45.11 10.54,47.87 10.77,48.11 33.5,48.11 33.77,47.85 v33.77,45.64 34.07,45.34 34.07,45.24 34.32,44.99 34.32,44.48 34.28,44.45 v34.28,37.24
DQ6  (via drill 0.35)
  Top 0.152: U2.40 35.67,44.5 v34.67,45.49 | U3.28 10.11,46.83 10.19,46.76 10.19,46.25 9.58,45.64 v9.58,45.59 | U1.50 35.46,33.45 v35.46,34.95
  Bottom 0.152: v9.58,45.59 9.58,45.64 10.19,46.25 10.19,46.76 10.11,46.83 10.11,47.96 10.57,48.41 33.73,48.41 34.12,48.03 34.12,46.33 34.67,45.77 v34.67,45.49 34.98,45.19 34.98,38.2 35.46,37.72 v35.46,34.95
DQ7  (via drill 0.35)
  Top 0.152: U3.29 9.61,46.49 v9.58,46.45 | v35.71,45.31 36.03,45 U2.41 | U1.49 35.01,32.51 35.5,32.51 36.27,33.27 36.27,35.26 36.63,35.61 v37.01,35.61
  Bottom 0.152: v9.58,46.45 9.58,48.29 9.98,48.69 9.98,48.72 33.88,48.72 34.47,48.13 34.47,46.56 v35.71,45.31 35.76,45.26 35.76,41.61 36.35,41.02 36.35,36.27 v37.01,35.61
E  (via drill 0.35)
  Top 0.152: U1.64 26.7,34.34 26.7,33.53 26.67,33.5 26.39,33.5 25.35,32.47 25.35,32.18 25.15,31.98 25.15,31.47 25.35,31.27 25.35,28.32 25.02,27.99 23.88,27.99 v23.34,28.52 | J1.6 20.36,9.1 18.58,10.88 18.58,15.13 18.64,15.19 18.64,19.19 v18.3,19.53
  Bottom 0.152: v23.34,28.52 23.34,23.42 20.09,20.17 18.95,20.17 18.62,19.84 18.6,19.84 v18.3,19.53
EPA0  (via drill 0.35)
  Top 0.152: v46.22,23.7 44.69,23.7 IC1.1
  Bottom 0.152: JPA0.2 42.91,23.36 42.91,22.89 43.07,22.73 45.7,22.73 46.22,23.25 v46.22,23.7
EPA1  (via drill 0.35)
  Top 0.152: v46.19,25.32 44.89,25.32 IC1.2
  Bottom 0.152: JPA1.2 42.7,26.21 42.77,26.21 43.1,26.54 43.92,26.54 43.94,26.52 44.74,26.52 45.94,25.32 v46.19,25.32
EPA2  (via drill 0.35)
  Top 0.152: v46.21,26.31 IC1.3
  Bottom 0.152: v46.21,26.31 45.7,26.31 45.14,26.87 43.05,26.87 42.8,27.13 JPA2.2
EPWP  (via drill 0.35)
  Top 0.152: v41.1,24.97 39.49,24.97 IC1.7
  Bottom 0.152: JPWP.2 42.56,29.73 42.56,30.19 42.42,30.33 41.6,30.33 41.47,30.19 41.47,28.49 41.34,28.36 41.34,25.21 v41.1,24.97
EXTPROTSW  (via drill 0.35)  (1 unrouted)
  Top 0.152: R8.1 5.2,37.13 v5.2,36.8 | v28.4,31.52 28.4,31.42 27.58,30.6 27.58,24.47 25.51,22.4 25.51,21.13 26.75,19.88 U1.12 | v33.55,31.5 30.51,31.5 30.5,31.49 v30.15,31.49 | v43.49,34.34 43.43,34.29 S1.2 | v21.57,31.39 22.34,31.39 22.84,31.88 23.57,31.88 23.92,32.23 23.92,32.74 23.81,32.86 v23.81,33.28
  Bottom 0.152: v30.15,31.49 v30.14,31.5 28.42,31.5 v28.4,31.52 27.34,31.52 26.71,30.89 25.41,30.89 24.92,31.38 24.92,32.17 v23.81,33.28 | v33.55,31.5 40.64,31.5 v43.49,34.34 | v5.2,36.8 5.25,36.86 18.55,36.86 19.79,38.09 19.78,38.1 21.41,38.1 21.76,37.74 21.76,37.24 21.41,36.89 21.41,31.54 v21.57,31.39
FPEJECT  (1 unrouted)
FPEJECT_I  (1 unrouted)
  Top 0.152: 34.76,4.75 34.76,6.21 35.2,6.65 35.2,8.36 35.74,8.89 R1.5
FPPWR
  Top 0.508: R5.1 32.7,12.7 32.91,12.49 32.91,12.03 33.15,11.79 33.61,11.79 R1.4
FPPWR_I  (1 unrouted)
GND  (via drill 0.35)  (62 unrouted)
  Top 0.152: U1.26 33.9,20.82 v33.77,20.96
  other vias: 45.67,31.06 46.13,24.51 24.31,40.89 24.51,35.94 27.81,45.06 34.26,35.89 27.79,38.35 31.93,6.17 34.95,9.12 17.73,32.08 30.96,37.95 30.94,35.81 38.33,35.59 38.07,16.03 33.78,23.62 11.15,37.85 11.25,32.28 6.2,38.43 18.41,34.57 6.6,35.99 5.26,45.77 27.56,21.69 25.15,25.93 32.21,16.18 35.1,16.61 37.82,17.32 34.29,17.98 30.38,44.98 32.13,25.65 32.38,33.3
  pour Bottom: 0,49.53 46.99,49.53 46.99,0 0,0
  pour Top: 0,49.53 46.99,49.53 46.99,0 0,0
HDDACT  (1 unrouted)
  Top 0.254: RN1.6 16.38,14.13 16.43,14.18 16.43,14.99 16.01,14.99 15.29,15.71 15.29,16.19 16.44,17.35 16.44,17.54
HDDACT_I  (via drill 0.35)  (1 unrouted)
  Top 0.152: 16.4,11.84 v17.6,10.64 | v21.95,10.69 30.38,10.69 v30.43,10.74 | v39.14,28.83 40.63,30.32 40.63,43.57 41.07,44.02 J4.2
  Bottom 0.152: v17.6,10.64 17.65,10.69 21.06,10.69 21.09,10.67 21.5,10.67 21.52,10.69 v21.95,10.69 | v39.14,28.83 39.42,28.55 39.42,25.41 39.37,25.36 39.37,24.67 39.42,24.62 39.42,19.74 35.43,15.74 35.41,15.74 34.88,15.21 34.88,15.19 v30.43,10.74
HDDLED  (via drill 0.35)  (1 unrouted)
  Top 0.152: v3.85,31.71 v3.83,31.72 | v13.43,22.15 13.4,22.12 RN3.6
  Bottom 0.152: v3.83,31.72 3.91,31.65 6.45,31.65 7.01,31.09 7.01,28.32 7.04,28.29 7.04,27.54 7.01,27.51 7.01,26.77 9.91,23.88 11.96,23.88 13.43,22.41 v13.43,22.15
K  (1 unrouted)
  Top 0.152: J1.16 25.36,8.97 25.76,9.38 30.51,9.38 30.54,9.35 31.86,9.35
LAD0  (via drill 0.35)
  Top 0.152: JP1.11 40.1,17.56 40.1,17.75 38.22,19.64 38.15,19.64 37.9,19.89 v37.62,19.89 | v36.93,23.49 36.93,23.56 36.34,24.15 36.34,24.24 35.78,24.8 34.85,24.8 U1.34
  Bottom 0.152: v37.62,19.89 36.93,20.57 v36.93,23.49
LAD1  (via drill 0.35)
  Top 0.152: v36.95,24.4 36.65,24.7 36.35,24.7 35.73,25.32 U1.35 | JP1.10 44.45,14.2 42.9,15.75 42.9,16.16 42.32,16.74 41.91,16.74 v38.41,20.24
  Bottom 0.152: v38.41,20.24 37.92,20.73 37.49,20.73 37.35,20.86 37.35,23.05 37.49,23.19 37.49,23.86 v36.95,24.4
LAD2  (via drill 0.35)
  Top 0.152: v37.68,15.04 37.1,15.62 v37.1,18.89 | v36.6,25.31 36.3,25.61 36.27,25.61 36.06,25.82 U1.36
  Bottom 0.152: JP1.8 43.46,11.66 41.06,11.66 v37.68,15.04 | v37.1,18.89 36.6,19.39 36.6,22.96 36.33,23.24 36.33,23.74 36.34,23.76 36.34,24.65 36.6,24.91 v36.6,25.31
LAD3  (via drill 0.35)
  Top 0.152: U1.37 35.48,26.32 35.59,26.22 36.09,26.22 36.17,26.29 v36.57,26.29 | v36.53,18.29 36.73,18.09 36.73,14.9 v36.77,14.86
  Bottom 0.152: v36.57,26.29 36.57,26.22 36.4,26.04 36.4,25.96 36,25.56 36,25.06 36.04,25.02 36.04,23.88 36.02,23.87 36.02,23.11 36.3,22.84 36.3,19.27 36.42,19.14 36.42,18.39 v36.53,18.29 | v36.77,14.86 40.97,10.67 JP1.7
LANACT  (1 unrouted)
  Top 0.254: R3.2 16.88,15.61 16.88,15.42 17.2,15.09
LANACT_I  (1 unrouted)
LANACT_O  (1 unrouted)
  Top 0.254: R3.6 15.99,17.78 15.99,18.09 15.6,18.48 15.29,18.48 14.21,19.56
LANLED  (via drill 0.35)  (1 unrouted)
  Top 0.152: v3.87,32.71 v3.86,32.72 | v14.34,22.12 14.34,21.36 RN3.5
  Bottom 0.152: v14.34,22.12 12.21,24.26 10.09,24.26 7.31,27.03 7.31,27.38 7.34,27.41 7.34,28.42 7.31,28.45 7.31,32.38 6.98,32.72 v3.86,32.72
LCLK  (via drill 0.35)
  Top 0.152: v36.12,27.1 35.87,26.85 35.16,26.85 35.14,26.82 U1.38 | v35.87,17.42 v35.87,14.73 | v38.62,7.98 38.62,6.34 JP1.1
  Bottom 0.152: v35.87,17.42 35.97,17.53 35.97,18.01 35.97,22.74 35.72,22.99 35.72,24 35.73,24.01 35.73,24.89 35.69,24.93 35.69,25.69 35.81,25.81 35.81,26.8 v36.12,27.1 | v35.87,14.73 35.87,10.73 v38.62,7.98
MNFLCE#  (via drill 0.35)
  Top 0.152: U2.11 18.43,43.37 19.14,43.37 19.58,42.93 19.58,41.38 v20.27,40.69 | v29.42,29.84 29.42,29.41 29.29,29.28 29.29,24.39 26.98,22.08 26.98,21.51 27.52,20.97 28.26,20.97 28.46,20.76 29.25,19.97 U1.17
  Bottom 0.152: v20.27,40.69 21.69,40.69 22.17,40.21 22.17,38.19 22.37,37.99 22.37,36.74 22.15,36.52 22.15,36.02 22.17,36 22.17,35.88 22.02,35.74 22.02,32.81 25.27,29.57 25.55,29.84 v29.42,29.84
N$1
  Top 0.254: LED2.A 2.53,16.38 R9.1
N$5
  Top 0.152: LED1.A R10.2
N$56
  Top 0.152: R1.3 37.17,9.54 36.39,8.76 36.39,8.64 36.25,8.51 36.13,8.51 R1.6
N$59  (via drill 0.35)
  Top 0.152: U1.39 33.94,27.32 33.93,27.33 33.35,26.75 v33.35,25.86 | v34.44,19.23 34.44,19 33.76,18.31 33.76,15.04 32.17,13.45
  Bottom 0.152: v33.35,25.86 32.61,25.12 32.61,24.11 32.61,23.01 34.09,23.01 34.29,22.81 34.29,22.43 34.37,22.35 34.37,21.54 34.91,21 34.91,20.56 34.44,20.09 v34.44,19.23
N$61  (via drill 0.35)
  Top 0.152: 38.06,8.51 38.18,8.51 39.09,9.42 39.09,11.15 38.28,11.96 | 38.28,11.96 37.68,12.56 | v36.09,28.68 35.74,28.32 U1.41 | v38.1,21.67 38.1,21.27 36.86,20.03 36.86,19.59 37.01,19.44 37.01,19.42 37.32,19.42 38.99,17.76 39.66,17.76 39.8,17.63 39.8,16.46 42.06,14.2 42.32,14.2 43.13,13.39 43.13,12.47 42.62,11.96 38.28,11.96
  Bottom 0.152: v36.09,28.68 36.09,27.88 36.36,27.61 37.06,27.61 38.1,26.57 v38.1,21.67
N$78  (via drill 0.35)
  Top 0.152: v14.8,11.41 v14.81,11.4 | v35.41,18.31 35.15,18.57 35.15,18.64 35.76,19.25 35.76,19.7 36.27,20.21 36.27,22.02 35.64,22.66 35.64,23.01 35.46,23.18 35.46,23.34 35.44,23.32 U1.31
  Bottom 0.152: v14.81,11.4 15.37,11.4 15.47,11.31 20.88,11.31 21.21,10.98 21.37,10.98 22.43,12.04 22.43,12.69 22.74,13 23.4,13 23.91,13.52 24.45,13.52 24.62,13.69 28.22,13.69 28.45,13.46 28.92,13.46 29.37,13.92 31.57,13.92 35.38,17.73 35.38,18.29 v35.41,18.31
N$79  (via drill 0.35)
  Top 0.152: U1.30 33.9,22.82 33.58,22.5 v33.6,22.48 | v23.72,15.26 21.11,12.65 v20.6,12.65 | v15.65,11.99 15.6,12.03
  Bottom 0.152: v23.72,15.26 26.31,15.26 26.8,15.75 29.36,15.75 29.82,16.21 30.34,16.21 30.83,16.7 30.83,16.88 31.44,17.48 31.44,17.83 32.84,19.22 32.84,21.89 33.43,22.48 v33.6,22.48 | v20.6,12.65 16.31,12.65 v15.65,11.99
OE#  (via drill 0.35)
  Top 0.152: U3.32 7.68,47.64 v7.29,48.03 | U2.43 37.65,46.03 35.87,46.03 v35.18,46.71 32.92,46.71 32.8,46.59 29.47,46.59 v29.29,46.41 | U1.15 28.25,20.06 27.96,20.36 27.24,20.36 26.24,21.36 26.24,22.25 28.22,24.23 28.2,29.98 29.31,31.09 29.31,32.19 v29.54,32.41
  Bottom 0.152: v7.29,48.03 8.28,49.02 34.01,49.02 35.18,47.85 v35.18,46.71 | v29.29,46.41 29.29,42.8 26.95,40.46 26.95,34.8 29.34,32.41 v29.54,32.41
REDLED  (via drill 0.35)  (1 unrouted)
  Top 0.152: 3.89,29.71 v3.86,29.74 | RN3.8 11.79,21.24 11.79,21.92 v11.56,22.15
  Bottom 0.152: v3.86,29.74 5.89,29.74 6.4,29.23 6.4,28.07 6.43,28.04 6.43,27.79 6.4,27.76 6.4,25.83 8.99,23.24 11.28,23.24 11.56,22.96 v11.56,22.15
REDLED_O  (1 unrouted)
REDLEDACT  (1 unrouted)
RS  (via drill 0.35)
  Top 0.152: U1.44 34.65,29.64 34.16,29.64 33.78,29.27 v33.78,29.23 | v30,17.04 30,14.33 29.23,13.56 29.02,13.56 28.7,13.25 28.7,13.03 v28.19,12.52 | J1.4 19.36,6.83 19.61,6.58 19.84,6.8 25.29,6.8 25.45,6.64 v25.82,6.64
  Bottom 0.152: v28.19,12.52 28.19,9.07 25.82,6.69 v25.82,6.64 | v30,17.04 30,18.44 29.67,18.77 31.32,20.42 31.32,20.67 31.54,20.89 31.54,23.4 31.37,23.58 31.37,25.65 33.37,27.65 33.37,28.55 33.6,28.78 33.6,28.93 33.78,29.11 v33.78,29.23
RW  (via drill 0.35)
  Top 0.152: U1.65 26.44,34.58 26.44,35.07 26.93,35.56 v27.58,35.56 | v20.34,3.56 20.34,2.25 J1.5 | v22.96,12.47 23.19,12.7 23.19,12.72 23.5,13.03 23.52,13.03 23.93,13.44 23.93,14.72 24.25,15.05 24.25,15.48 24.18,15.56 v24.18,16.38
  Bottom 0.152: v27.58,35.56 29.52,33.63 30.43,33.63 30.5,33.55 30.5,31.88 30.73,31.66 30.73,30.39 30.53,30.18 30.53,28.91 30.22,28.6 29.62,28.6 28.93,27.91 28.93,22.57 29.11,22.39 29.11,21.95 28.79,21.64 28.66,21.64 26.37,19.35 26.37,18.79 26.06,18.48 26.06,17.97 25.9,17.81 25.9,17.76 25.24,17.1 24.77,17.1 24.41,16.73 24.41,16.61 v24.18,16.38 | v22.96,12.47 22.96,10.57 20.32,7.93 20.32,3.58 v20.34,3.56
SCL
  Top 0.152: JP1.13 41.91,18.64 42.79,19.52 42.4,19.91 42.9,20.42 42.9,21.24 42.16,21.97 42.16,22.3 42.1,22.36 42.1,24.71 40.5,26.31 IC1.6
SDA
  Top 0.152: IC1.5 40.92,27.58 42.47,26.04 42.47,22.1 43.21,21.36 43.21,20.29 42.83,19.91 JP1.14
SWBANK1  (via drill 0.35)  (2 unrouted)
  Top 0.152: 5.16,28.75 v3.86,28.75 | 7.71,23.35 v7.62,23.44 | U1.23 32.07,19.43 32.07,20.4 v32.16,20.32
  Bottom 0.152: v3.86,28.75 5.28,28.75 6.12,27.91 6.04,27.84 6.04,25.7 7.62,24.13 v7.62,23.44 12.2,18.87 12.2,18.88 12.55,19.23 13.05,19.23 15.39,16.89 15.39,15.9 15.62,15.67 16.95,15.67 17.78,14.84 18.29,14.84 18.64,15.19 18.64,15.67 20.48,15.67 20.75,15.39 21.26,15.39 21.66,15.8 25.89,15.8 26.17,16.07 29.21,16.07 29.64,16.51 30.22,16.51 30.53,16.82 30.53,17 31.14,17.61 31.14,18 32.16,19.02 v32.16,20.32
SWBANK2  (via drill 0.35)  (2 unrouted)
  Top 0.152: v3.84,27.71 v3.83,27.71 | 7.63,22.55 v7.62,22.54 | U1.27 34.66,21.49 33.78,21.49 33.6,21.67 v33.6,21.72
  Bottom 0.152: v3.83,27.71 3.89,27.66 5.13,27.66 5.71,27.08 5.71,25.53 7.01,24.23 7.01,23.19 7.14,23.07 7.14,22.88 7.49,22.54 v7.62,22.54 14.43,15.72 14.43,14.72 14.79,14.36 15.29,14.36 15.64,14.72 15.64,15.37 16.82,15.37 17.66,14.53 18.41,14.53 19.25,15.37 20.35,15.37 20.63,15.09 21.38,15.09 21.66,15.37 22.87,15.37 23.5,14.73 23.94,14.73 24.17,14.96 26.44,14.96 26.85,15.37 27.23,15.37 27.3,15.44 29.54,15.44 30,15.9 30.47,15.9 31.14,16.57 31.14,16.75 31.75,17.36 31.75,17.65 33.2,19.1 33.2,21.31 v33.6,21.72
SWBANK3  (via drill 0.35)  (1 unrouted)
  Top 0.152: 3.83,26.71 v3.81,26.7 | 7.72,21.75 v7.6,21.63 | U1.28 35.61,21.82 35.66,21.77 35.64,21.74 35.64,20.64 35.64,20.6 35.41,20.37 34.72,20.37 33.86,19.51 33.86,18.86 33.12,18.12 33.12,18.09 v33.1,18.07
  Bottom 0.152: v3.81,26.7 4.75,26.7 5.41,26.04 5.41,23.81 v7.6,21.63 14.12,15.1 14.12,14.59 14.66,14.06 15.41,14.06 16.3,14.94 16.82,14.94 17.53,14.23 18.54,14.23 19.37,15.06 20.22,15.06 20.5,14.79 21.51,14.79 21.79,15.06 22.64,15.06 23.35,14.35 23.45,14.35 23.53,14.43 24.07,14.43 24.29,14.66 26.57,14.66 26.97,15.06 29.62,15.06 30.15,15.6 30.6,15.6 31.44,16.45 31.44,16.62 32.05,17.23 32.05,17.5 32.62,18.07 v33.1,18.07
SWBANK4  (via drill 0.35)  (2 unrouted)
  Top 0.152: 5.17,25.68 v3.86,25.68 | 7.83,20.95 v7.6,20.72 | U1.29 34.88,22.28 35.59,22.28 35.97,21.89 35.97,20.46 35.27,19.76 v35.23,19.76
  Bottom 0.152: v3.86,25.68 4.7,25.68 5.11,25.27 5.11,23.06 7.45,20.72 v7.6,20.72 13.82,14.49 13.82,14.46 14.53,13.75 18.49,13.75 19.5,14.76 20.1,14.76 20.38,14.48 21.64,14.48 21.91,14.76 22.51,14.76 23.22,14.05 23.58,14.05 23.66,14.12 24.2,14.12 24.42,14.35 26.69,14.35 27.1,14.76 31.91,14.76 34.83,17.68 34.83,18.81 35.23,19.2 v35.23,19.76
TCK  (via drill 0.35)
  Top 0.152: U1.24 32.57,19.06 32.57,18.57 32.44,18.44 31.95,18.44 31.75,18.24 31.75,17.36 31.52,17.13 31.52,14.02 31.14,13.64 v31.14,13.26 | v28.12,8.13 27.92,7.93 J1.20
  Bottom 0.152: v31.14,13.26 31.14,12.62 30.78,12.26 30.06,12.26 29.75,11.96 29.75,11.51 29.77,11.49 29.77,8.38 29.52,8.13 v28.12,8.13
TDI  (via drill 0.35)
  Top 0.152: J1.18 26.36,6.12 v26.31,6.07 25.59,6.07 25.16,6.5 23.86,6.5 23.43,6.07 21.97,6.07 v21.87,5.97 | U1.2 21.75,18.66 21.54,18.45 21.54,18.06 21.34,17.86 v21.34,17.75 | v22.43,18.03 22.43,16.91 22.2,16.68 22.2,15.01 20.27,13.08 20.27,13.07 20.07,12.87 20.07,12.32 21.41,10.97 21.41,10.47 21.73,10.16 22.15,10.16 22.84,9.47 v22.84,9.45
  Bottom 0.152: v21.34,17.75 21.44,17.86 22.25,17.86 v22.43,18.03 | v22.84,9.45 22.84,6.93 v21.87,5.97
TDO  (via drill 0.35)
  Top 0.152: v22.55,35.52 22.25,35.2 22.07,35.2 21.75,34.89 U1.74 | v26.54,31.47 26.54,25.32 v26.29,25.07 | v32.16,21.26 31.09,22.33 v28.45,22.33 | v30.61,17.83 30.61,14.4 v29.23,13.03 | v29.18,8.84 29.18,7.29 26.36,4.46 J1.17
  Bottom 0.152: v22.55,35.52 22.55,35.46 25.22,32.79 25.22,31.5 25.54,31.19 25.97,31.19 26.25,31.47 v26.54,31.47 | v26.29,25.07 28.45,22.91 v28.45,22.33 | v32.16,21.26 32.16,21.07 31.63,20.54 31.63,19.69 30.3,18.36 30.3,18.14 v30.61,17.83 | v29.23,13.03 29.23,8.89 v29.18,8.84
TMS  (via drill 0.35)
  Top 0.152: U1.52 32.75,35.05 32.82,35.11 32.82,35.61 32.46,35.97 32.38,35.97 v32.11,36.24 | v27.84,16.64 27.84,15.67 27.28,15.11 26.96,15.11 26.44,14.59 26.44,13.06 v26.44,11.53 | v26.36,9.98 30.66,9.98 v30.76,9.88 | v27.41,3.61 27.41,2.28 J1.19
  Bottom 0.152: v32.11,36.24 32.38,35.97 32.46,35.97 32.77,35.66 32.77,35.17 32.94,35 32.94,32.82 32.69,32.57 32.69,29.83 32.57,29.71 32.57,29.06 32.41,28.9 32.41,27.98 30.45,26.02 30.45,23.2 30.63,23.02 30.63,21.32 29.43,20.12 29.29,20.12 28.12,18.95 28.12,18.1 27.89,17.87 27.89,17.43 28.14,17.18 28.14,16.94 v27.84,16.64 | v26.44,11.53 26.44,10.06 v26.36,9.98 | v30.76,9.88 30.76,6.02 29.41,4.67 28.17,4.67 27.41,3.91 v27.41,3.61
VO
  Top 0.152: R11.1 11.37,7.66 16.15,2.87 16.66,3.37 17.21,3.37 17.44,3.61 19.33,3.61 19.33,2.26 J1.3 | R12.1 8.35,14.83 R11.2
  Top 0.254: R11.1 R11.2
WE#  (via drill 0.35)
  Top 0.152: U2.44 36.87,46.5 35.64,47.73 33.08,47.73 v32.55,47.2 | U3.7 11.11,29.7 v11.23,29.82 | v27.33,14.22 28.65,15.54 28.65,15.77 28.95,16.07 28.95,17.87 28.75,18.07 U1.16 28.77,19.26 28.77,19.97 28.73,20.02 28.73,20.07 28.13,20.66 27.37,20.66 26.64,21.39 26.64,22.2 28.57,24.13 28.57,28.27 28.78,28.47 28.78,30.12 29.62,30.97 29.62,31.72 29.93,32.03 32.17,32.03 32.22,32.08 32.63,32.08 33.35,32.8 33.66,32.8 34.01,33.15 34.01,33.55 v34.6,34.14
  Bottom 0.152: v11.23,29.82 7.6,33.45 3.73,33.45 3.2,32.92 3.2,23.85 13.6,13.45 23.41,13.45 23.78,13.82 24.32,13.82 24.55,14.05 27.15,14.05 v27.33,14.22 | v32.55,47.2 32.55,36.6 32.64,36.52 32.64,36.22 33.12,35.74 33.12,35.61 v34.6,34.14

## Text on the board
bPlace: VCC | GND
bNames: Team-Donkey.com / KingLuxor